# EAGLE design transmission sorter copy (EAGLE 4.13)
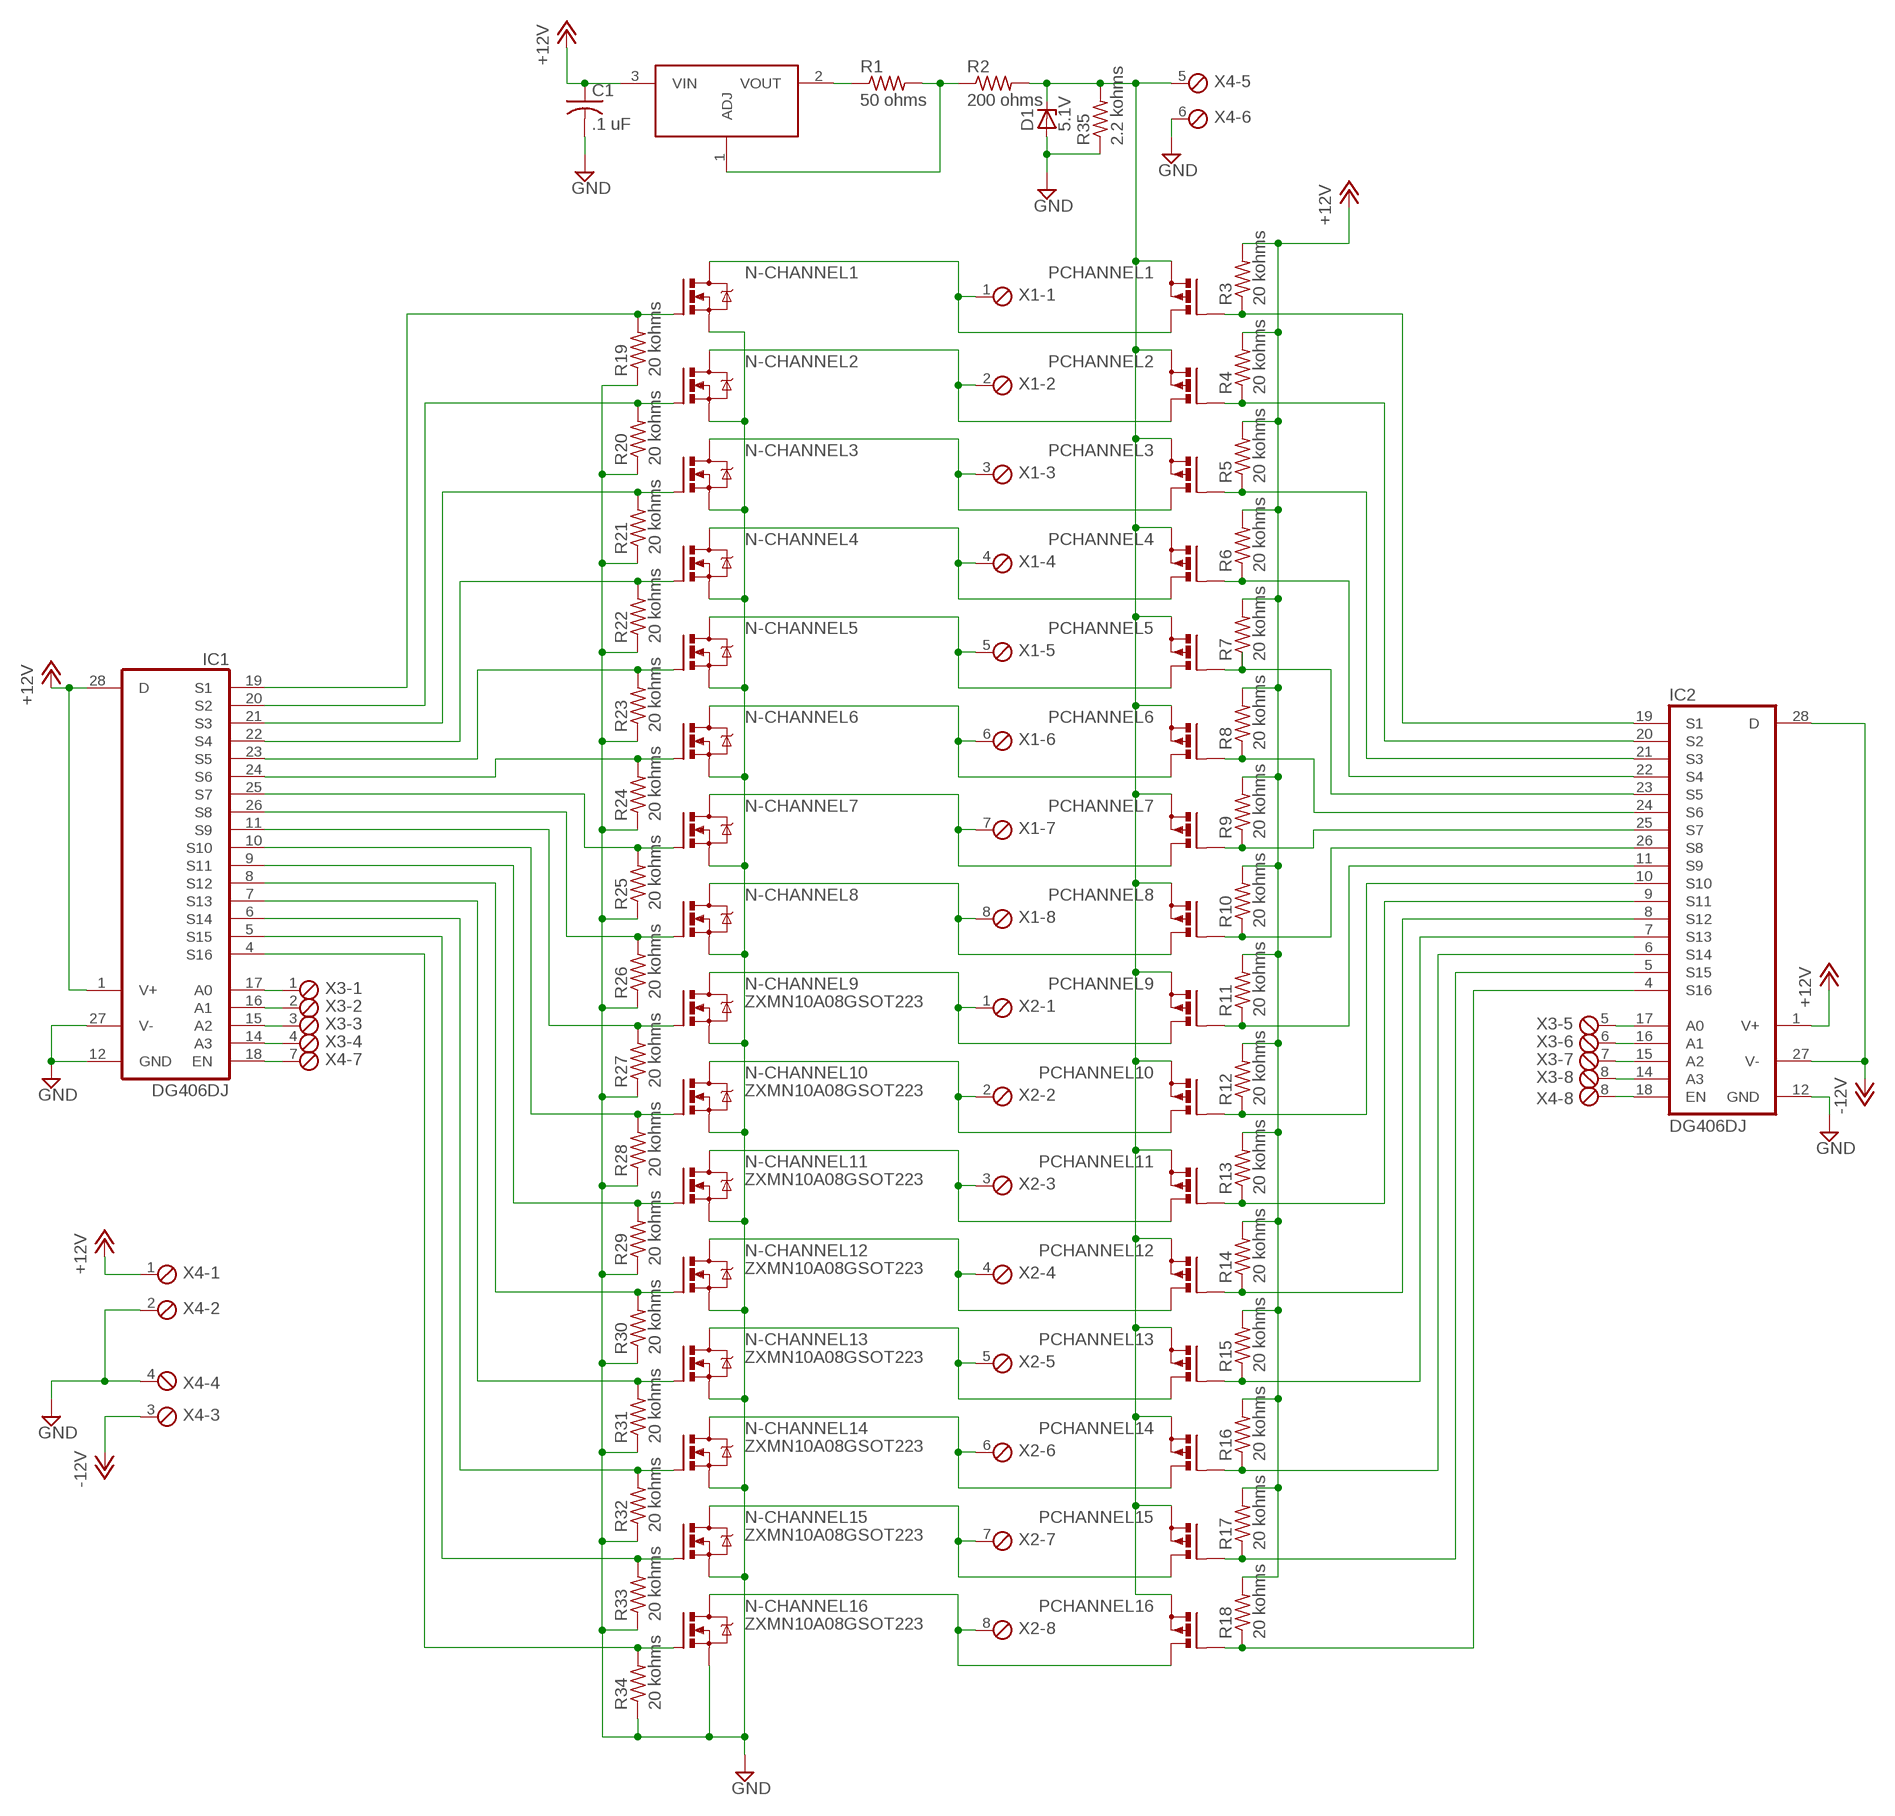
[diagram p0: schematic, sheet 1]

## Parts
C1  .1 uF  CAPACITOR-NO-POLARITYC1210  [C1210]
D1  5.1V  ZENER-DIODEC1702-15  [C1702-15]
IC1  DG406DJ  [DIL28-6]
IC2  DG406DJ  [DIL28-6]
N-CHANNEL1  ZXMN10A08GSOT223  [SOT223R_INFINEON]
N-CHANNEL2  ZXMN10A08GSOT223  [SOT223R_INFINEON]
N-CHANNEL3  ZXMN10A08GSOT223  [SOT223R_INFINEON]
N-CHANNEL4  ZXMN10A08GSOT223  [SOT223R_INFINEON]
N-CHANNEL5  ZXMN10A08GSOT223  [SOT223R_INFINEON]
N-CHANNEL6  ZXMN10A08GSOT223  [SOT223R_INFINEON]
N-CHANNEL7  ZXMN10A08GSOT223  [SOT223R_INFINEON]
N-CHANNEL8  ZXMN10A08GSOT223  [SOT223R_INFINEON]
N-CHANNEL9  ZXMN10A08GSOT223  [SOT223R_INFINEON]
N-CHANNEL10  ZXMN10A08GSOT223  [SOT223R_INFINEON]
N-CHANNEL11  ZXMN10A08GSOT223  [SOT223R_INFINEON]
N-CHANNEL12  ZXMN10A08GSOT223  [SOT223R_INFINEON]
N-CHANNEL13  ZXMN10A08GSOT223  [SOT223R_INFINEON]
N-CHANNEL14  ZXMN10A08GSOT223  [SOT223R_INFINEON]
N-CHANNEL15  ZXMN10A08GSOT223  [SOT223R_INFINEON]
N-CHANNEL16  ZXMN10A08GSOT223  [SOT223R_INFINEON]
PCHANNEL1  PMOSFET_P  [SOT223]
PCHANNEL2  PMOSFET_P  [SOT223]
PCHANNEL3  PMOSFET_P  [SOT223]
PCHANNEL4  PMOSFET_P  [SOT223]
PCHANNEL5  PMOSFET_P  [SOT223]
PCHANNEL6  PMOSFET_P  [SOT223]
PCHANNEL7  PMOSFET_P  [SOT223]
PCHANNEL8  PMOSFET_P  [SOT223]
PCHANNEL9  PMOSFET_P  [SOT223]
PCHANNEL10  PMOSFET_P  [SOT223]
PCHANNEL11  PMOSFET_P  [SOT223]
PCHANNEL12  PMOSFET_P  [SOT223]
PCHANNEL13  PMOSFET_P  [SOT223]
PCHANNEL14  PMOSFET_P  [SOT223]
PCHANNEL15  PMOSFET_P  [SOT223]
PCHANNEL16  PMOSFET_P  [SOT223]
R1  50 ohms  RESISITOR0411/3V  [0411V]
R2  200 ohms  RESISITORM1206  [M1206]
R3  20 kohms  RESISITORM1206  [M1206]
R4  20 kohms  RESISITORM1206  [M1206]
R5  20 kohms  RESISITORM1206  [M1206]
R6  20 kohms  RESISITORM1206  [M1206]
R7  20 kohms  RESISITORM1206  [M1206]
R8  20 kohms  RESISITORM1206  [M1206]
R9  20 kohms  RESISITORM1206  [M1206]
R10  20 kohms  RESISITORM1206  [M1206]
R11  20 kohms  RESISITORM1206  [M1206]
R12  20 kohms  RESISITORM1206  [M1206]
R13  20 kohms  RESISITORM1206  [M1206]
R14  20 kohms  RESISITORM1206  [M1206]
R15  20 kohms  RESISITORM1206  [M1206]
R16  20 kohms  RESISITORM1206  [M1206]
R17  20 kohms  RESISITORM1206  [M1206]
R18  20 kohms  RESISITORM1206  [M1206]
R19  20 kohms  RESISITORM1206  [M1206]
R20  20 kohms  RESISITORM1206  [M1206]
R21  20 kohms  RESISITORM1206  [M1206]
R22  20 kohms  RESISITORM1206  [M1206]
R23  20 kohms  RESISITORM1206  [M1206]
R24  20 kohms  RESISITORM1206  [M1206]
R25  20 kohms  RESISITORM1206  [M1206]
R26  20 kohms  RESISITORM1206  [M1206]
R27  20 kohms  RESISITORM1206  [M1206]
R28  20 kohms  RESISITORM1206  [M1206]
R29  20 kohms  RESISITORM1206  [M1206]
R30  20 kohms  RESISITORM1206  [M1206]
R31  20 kohms  RESISITORM1206  [M1206]
R32  20 kohms  RESISITORM1206  [M1206]
R33  20 kohms  RESISITORM1206  [M1206]
R34  20 kohms  RESISITORM1206  [M1206]
R35  2.2 kohms  RESISITORM1206  [M1206]
U$1  LM317123  [TO220S]
X1  MPT8  [8POL254]
X2  MPT8  [8POL254]
X3  MPT8  [8POL254]
X4  MPT8  [8POL254]

## Nets
+12V: C1.1 IC1.1(V+) IC1.28(D) IC2.1(V+) R3.2 R4.2 R5.2 R6.2 R7.2 R8.2 R9.2 R10.2 R11.2 R12.2 R13.2 R14.2 R15.2 R16.2 R17.2 R18.2 U$1.3(VIN) X4.1
-12V: IC2.27(V-) IC2.28(D) X4.3
GND: C1.2 D1.A IC1.12(GND) IC1.27(V-) IC2.12(GND) N-CHANNEL1.3(S) N-CHANNEL2.3(S) N-CHANNEL3.3(S) N-CHANNEL4.3(S) N-CHANNEL5.3(S) N-CHANNEL6.3(S) N-CHANNEL7.3(S) N-CHANNEL8.3(S) N-CHANNEL9.3(S) N-CHANNEL10.3(S) N-CHANNEL11.3(S) N-CHANNEL12.3(S) N-CHANNEL13.3(S) N-CHANNEL14.3(S) N-CHANNEL15.3(S) N-CHANNEL16.3(S) R19.1 R20.1 R21.1 R22.1 R23.1 R24.1 R25.1 R26.1 R27.1 R28.1 R29.1 R30.1 R31.1 R32.1 R33.1 R34.1 R35.1 X4.2 X4.4 X4.6
N$1: R1.1 U$1.2(VOUT)
N$2: IC2.17(A0) X3.5
N$3: D1.C PCHANNEL1.3(S) PCHANNEL2.3(S) PCHANNEL3.3(S) PCHANNEL4.3(S) PCHANNEL5.3(S) PCHANNEL6.3(S) PCHANNEL7.3(S) PCHANNEL8.3(S) PCHANNEL9.3(S) PCHANNEL10.3(S) PCHANNEL11.3(S) PCHANNEL12.3(S) PCHANNEL13.3(S) PCHANNEL14.3(S) PCHANNEL15.3(S) PCHANNEL16.3(S) R2.2 R35.2 X4.5
N$4: IC2.11(S9) PCHANNEL9.1(G) R11.1
N$5: R1.2 R2.1 U$1.1(ADJ)
N$6: IC2.26(S8) PCHANNEL8.1(G) R10.1
N$7: IC2.10(S10) PCHANNEL10.1(G) R12.1
N$8: IC2.9(S11) PCHANNEL11.1(G) R13.1
N$9: IC2.8(S12) PCHANNEL12.1(G) R14.1
N$10: IC2.7(S13) PCHANNEL13.1(G) R15.1
N$11: IC2.6(S14) PCHANNEL14.1(G) R16.1
N$12: IC2.5(S15) PCHANNEL15.1(G) R17.1
N$13: IC2.4(S16) PCHANNEL16.1(G) R18.1
N$14: IC2.25(S7) PCHANNEL7.1(G) R9.1
N$15: IC2.24(S6) PCHANNEL6.1(G) R8.1
N$16: IC2.23(S5) PCHANNEL5.1(G) R7.1
N$17: IC2.22(S4) PCHANNEL4.1(G) R6.1
N$18: IC2.21(S3) PCHANNEL3.1(G) R5.1
N$19: IC2.20(S2) PCHANNEL2.1(G) R4.1
N$20: IC2.19(S1) PCHANNEL1.1(G) R3.1
N$21: N-CHANNEL7.2(D) PCHANNEL7.2(D) X1.7
N$22: N-CHANNEL6.2(D) PCHANNEL6.2(D) X1.6
N$23: IC1.19(S1) N-CHANNEL1.1(G) R19.2
N$24: IC1.20(S2) N-CHANNEL2.1(G) R20.2
N$25: IC1.21(S3) N-CHANNEL3.1(G) R21.2
N$26: IC1.22(S4) N-CHANNEL4.1(G) R22.2
N$27: IC1.23(S5) N-CHANNEL5.1(G) R23.2
N$28: IC1.24(S6) N-CHANNEL6.1(G) R24.2
N$29: IC1.25(S7) N-CHANNEL7.1(G) R25.2
N$30: IC1.26(S8) N-CHANNEL8.1(G) R26.2
N$31: IC1.11(S9) N-CHANNEL9.1(G) R27.2
N$32: IC1.10(S10) N-CHANNEL10.1(G) R28.2
N$33: IC1.9(S11) N-CHANNEL11.1(G) R29.2
N$34: IC1.8(S12) N-CHANNEL12.1(G) R30.2
N$35: IC1.7(S13) N-CHANNEL13.1(G) R31.2
N$36: IC1.6(S14) N-CHANNEL14.1(G) R32.2
N$37: IC1.5(S15) N-CHANNEL15.1(G) R33.2
N$38: IC1.4(S16) N-CHANNEL16.1(G) R34.2
N$39: N-CHANNEL16.2(D) PCHANNEL16.2(D) X2.8
N$40: N-CHANNEL15.2(D) PCHANNEL15.2(D) X2.7
N$41: N-CHANNEL14.2(D) PCHANNEL14.2(D) X2.6
N$42: N-CHANNEL13.2(D) PCHANNEL13.2(D) X2.5
N$43: N-CHANNEL12.2(D) PCHANNEL12.2(D) X2.4
N$44: N-CHANNEL11.2(D) PCHANNEL11.2(D) X2.3
N$45: N-CHANNEL10.2(D) PCHANNEL10.2(D) X2.2
N$46: N-CHANNEL9.2(D) PCHANNEL9.2(D) X2.1
N$47: N-CHANNEL8.2(D) PCHANNEL8.2(D) X1.8
N$48: N-CHANNEL5.2(D) PCHANNEL5.2(D) X1.5
N$49: N-CHANNEL4.2(D) PCHANNEL4.2(D) X1.4
N$50: N-CHANNEL3.2(D) PCHANNEL3.2(D) X1.3
N$51: N-CHANNEL2.2(D) PCHANNEL2.2(D) X1.2
N$52: N-CHANNEL1.2(D) PCHANNEL1.2(D) X1.1
N$53: IC2.16(A1) X3.6
N$54: IC2.15(A2) X3.7
N$55: IC2.14(A3) X3.8
N$56: IC1.17(A0) X3.1
N$57: IC1.16(A1) X3.2
N$58: IC1.15(A2) X3.3
N$59: IC1.14(A3) X3.4
N$60: IC2.18(EN) X4.8
N$61: IC1.18(EN) X4.7

## Library data of the parts
C1 = 1 Dan's Common Parts:CAPACITOR-NO-POLARITY: CAPACITOR, American symbol
D1 = 1 Dan's Common Parts:ZENER-DIODE: Z-Diode
IC1 IC2 = maxim:DG406DJ: ANALOG MULTIPLEXER
N-CHANNEL1-N-CHANNEL16 = 1 Dan's Common Parts:ZXMN10A08G: N-CHANNEL MOS FET
PCHANNEL1-PCHANNEL16 = 1 Dan's Common Parts:PMOSFET_P: Power MOSFET P-Channel
R1-R35 = 1 Dan's Common Parts:RESISITOR: RESISTOR, American symbol
U$1 = 1 Dan's Common Parts:LM317
X1-X4 = con-phoenix-254:MPT8: PHOENIX CONNECTOR

## Board
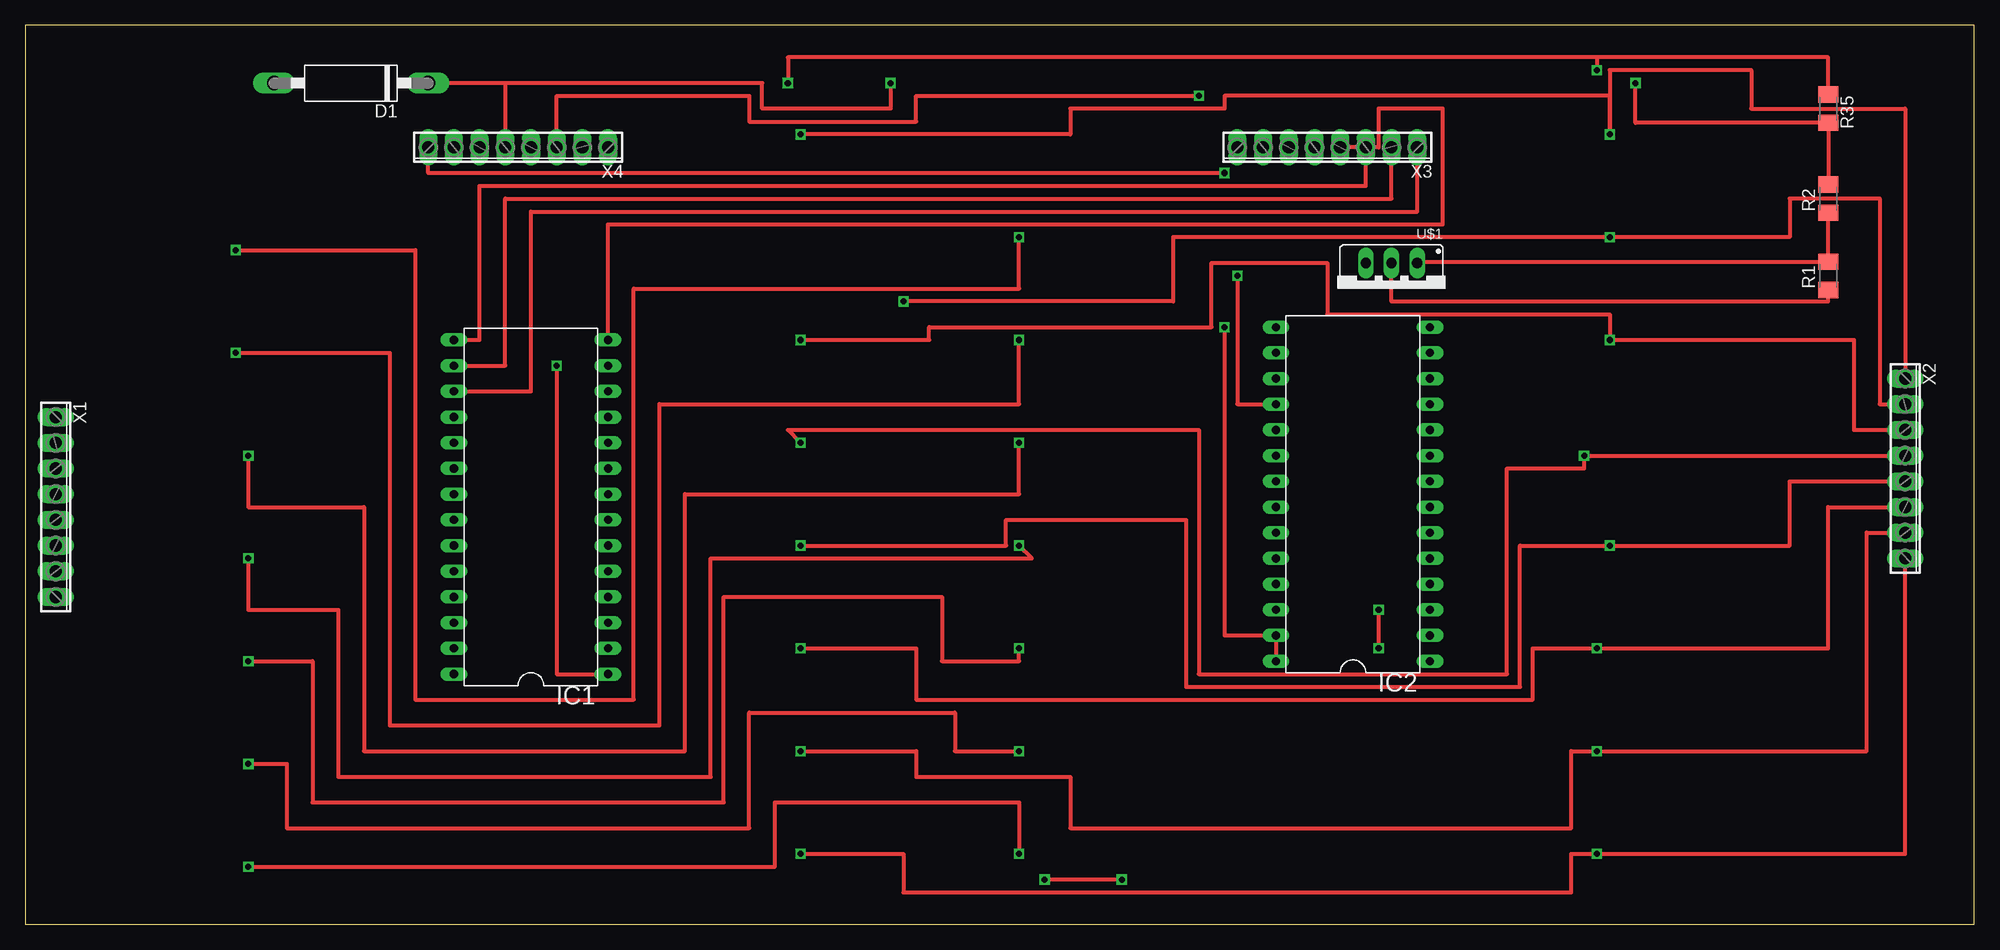
[diagram p1: board, top side]
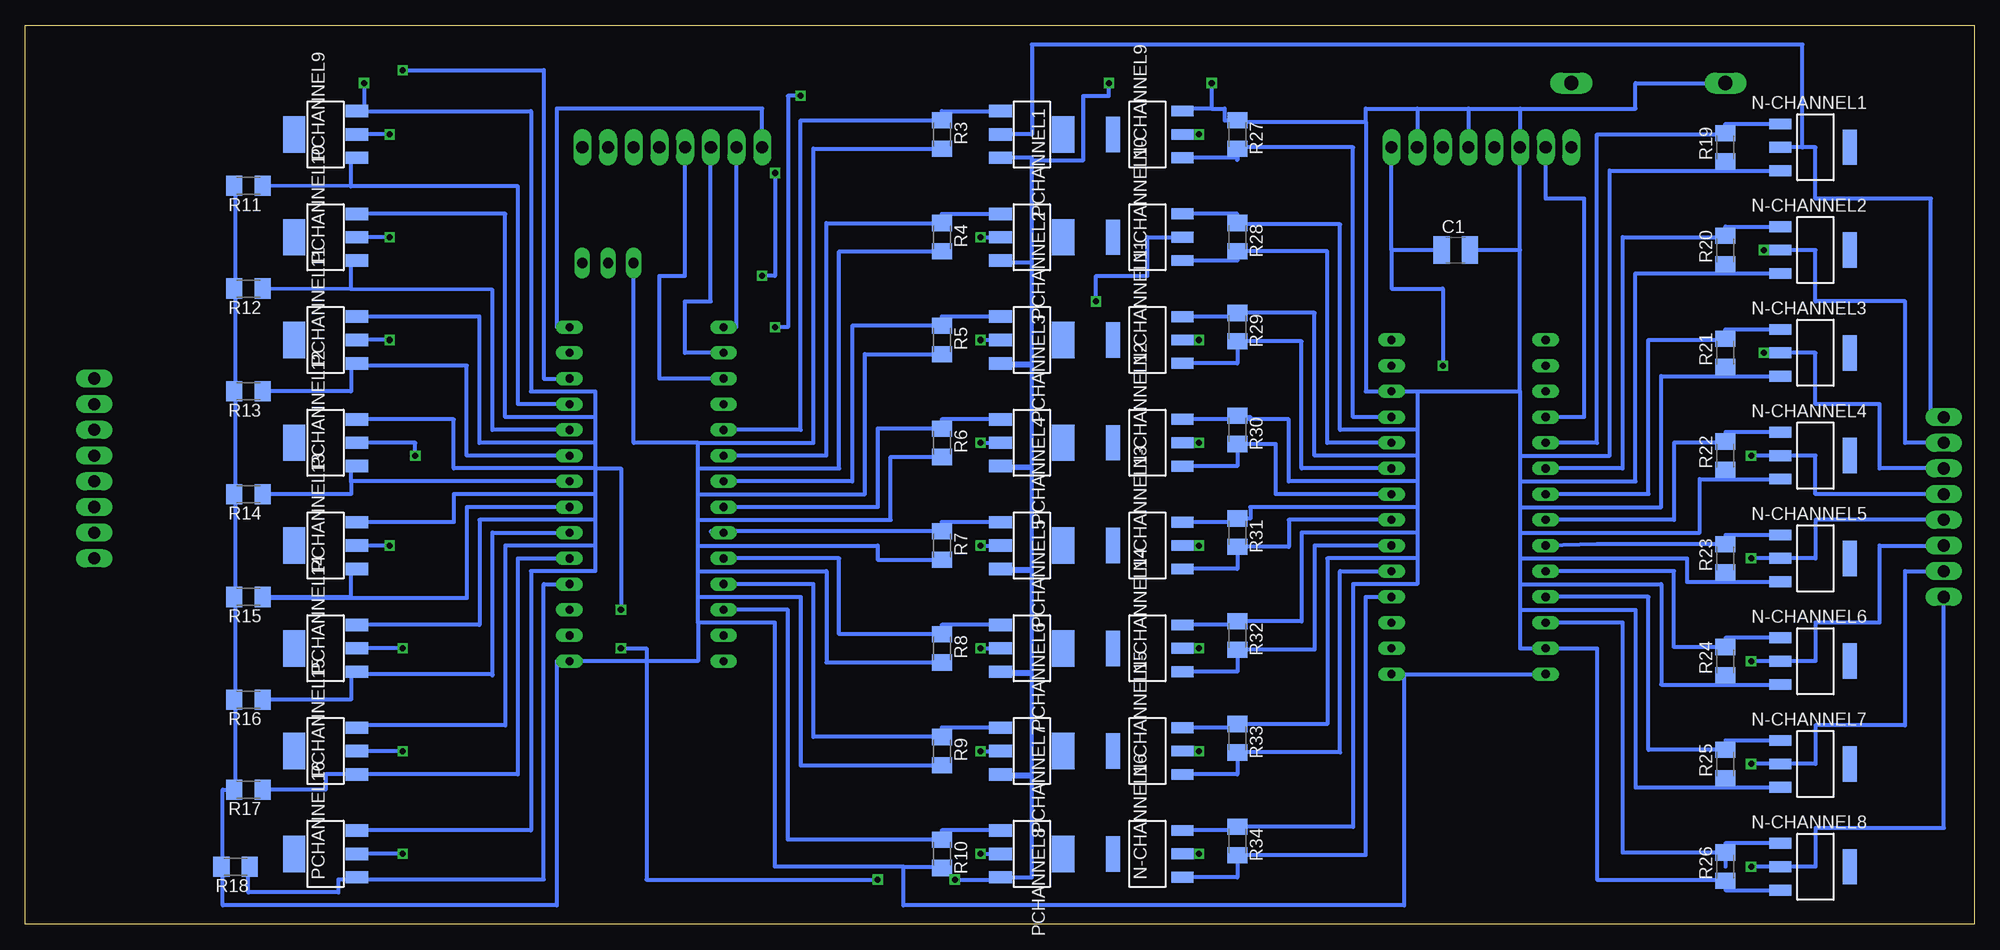
[diagram p2: board, bottom side, seen from below]

Size 192.71 x 88.89 mm. Coordinates in mm from the lower left corner, seen from the top.
Outline: 0,0 192.71,0 192.71,88.89 0,88.89 0,0
Copper layers (1*16): Top 0.035mm / dielectric 1.5mm / Bottom 0.035mm
Design rules "default": minimum track width 10mil, minimum drill 24mil, track to track 8mil, track to pad 8mil, pad to pad 8mil, via to via 8mil, smd to smd 8mil, copper to edge 40mil, drill to drill 8mil, minimum pad ring 10mil, minimum via ring 8mil, stop-mask expansion 4mil, vias tented up to drill 0mil, thermal gap 10mil

### Footprints (pad centres in the part's own frame; a part is rotated, then mirrored left to right if it is on the bottom)
C1210 = smd 1.6 x 2.7: 1 -1.4,0; 2 1.4,0
C1702-15 = drill 1.397 long: A 7.62,0; C -7.62,0
DIL28-6 = drill 0.813 long: 1 -16.51,-7.62; 2 -13.97,-7.62; 3 -11.43,-7.62; 4 -8.89,-7.62; 5 -6.35,-7.62; 6 -3.81,-7.62; 7 -1.27,-7.62; 8 1.27,-7.62; 9 3.81,-7.62; 10 6.35,-7.62; 11 8.89,-7.62; 12 11.43,-7.62; 13 13.97,-7.62; 14 16.51,-7.62; 15 16.51,7.62; 16 13.97,7.62; 17 11.43,7.62; 18 8.89,7.62; 19 6.35,7.62; 20 3.81,7.62; 21 1.27,7.62; 22 -1.27,7.62; 23 -3.81,7.62; 24 -6.35,7.62; 25 -8.89,7.62; 26 -11.43,7.62; 27 -13.97,7.62; 28 -16.51,7.62
SOT223R_INFINEON = smd 1.067 x 2.184: 1 -2.311,-3.479; 2 0,-3.48; 3 2.312,-3.48 | smd 3.5 x 1.4: 4 0,3.404
SOT223 = smd 1.219 x 2.235: 1 -2.311,-3.099; 2 0,-3.099; 3 2.311,-3.099 | smd 3.6 x 2.2: 4 0,3.099
M1206 = smd 1.6 x 2: 1 -1.4,0; 2 1.4,0
TO220S = drill 1.016 long: 1 -2.54,-2.54; 2 0,-2.54; 3 2.54,-2.54
8POL254 = drill 1.2 long: 1 -8.89,0; 2 -6.35,0; 3 -3.81,0; 4 -1.27,0; 5 1.27,0; 6 3.81,0; 7 6.35,0; 8 8.89,0

### Placement (x,y rotation side)
C1  51.27,66.67 0 bottom
D1  32.22,83.18 180 top
IC1  50,41.27 90 top
IC2  131.28,42.54 90 top
N-CHANNEL1  15.71,76.83 270 bottom
N-CHANNEL2  15.71,66.67 270 bottom
N-CHANNEL3  15.71,56.51 270 bottom
N-CHANNEL4  15.71,46.35 270 bottom
N-CHANNEL5  15.71,36.19 270 bottom
N-CHANNEL6  15.71,26.03 270 bottom
N-CHANNEL7  15.71,15.87 270 bottom
N-CHANNEL8  15.71,5.71 270 bottom
N-CHANNEL9  81.75,78.1 90 bottom
N-CHANNEL10  81.75,67.94 90 bottom
N-CHANNEL11  81.75,57.78 90 bottom
N-CHANNEL12  81.75,47.62 90 bottom
N-CHANNEL13  81.75,37.46 90 bottom
N-CHANNEL14  81.75,27.3 90 bottom
N-CHANNEL15  81.75,17.14 90 bottom
N-CHANNEL16  81.75,6.98 90 bottom
PCHANNEL1  93.18,78.1 270 bottom
PCHANNEL2  93.18,67.94 270 bottom
PCHANNEL3  93.18,57.78 270 bottom
PCHANNEL4  93.18,47.62 270 bottom
PCHANNEL5  93.18,37.46 270 bottom
PCHANNEL6  93.18,27.3 270 bottom
PCHANNEL7  93.18,17.14 270 bottom
PCHANNEL8  93.18,6.98 270 bottom
PCHANNEL9  163.03,78.1 90 bottom
PCHANNEL10  163.03,67.94 90 bottom
PCHANNEL11  163.03,57.78 90 bottom
PCHANNEL12  163.03,47.62 90 bottom
PCHANNEL13  163.03,37.46 90 bottom
PCHANNEL14  163.03,27.3 90 bottom
PCHANNEL15  163.03,17.14 90 bottom
PCHANNEL16  163.03,6.98 90 bottom
R1  50 ohms  [M1206]  178.27,64.13 90 top
R2  178.27,71.75 90 top
R3  102.07,78.1 270 bottom
R4  102.07,67.94 270 bottom
R5  102.07,57.78 270 bottom
R6  102.07,47.62 270 bottom
R7  102.07,37.46 270 bottom
R8  102.07,27.3 270 bottom
R9  102.07,17.14 270 bottom
R10  102.07,6.98 270 bottom
R11  170.65,73.02 180 bottom
R12  170.65,62.86 180 bottom
R13  170.65,52.7 180 bottom
R14  170.65,42.54 180 bottom
R15  170.65,32.38 180 bottom
R16  170.65,22.22 180 bottom
R17  170.65,13.33 180 bottom
R18  171.92,5.71 180 bottom
R19  24.6,76.83 90 bottom
R20  24.6,66.67 90 bottom
R21  24.6,56.51 90 bottom
R22  24.6,46.35 90 bottom
R23  24.6,36.19 90 bottom
R24  24.6,26.03 90 bottom
R25  24.6,15.87 90 bottom
R26  24.6,5.71 90 bottom
R27  72.86,78.1 270 bottom
R28  72.86,67.94 270 bottom
R29  72.86,59.05 270 bottom
R30  72.86,48.89 270 bottom
R31  72.86,38.73 270 bottom
R32  72.86,28.57 270 bottom
R33  72.86,18.41 270 bottom
R34  72.86,8.25 270 bottom
R35  178.27,80.64 270 top
U$1  135.09,62.86 180 top
X1  3.01,41.27 270 top
X2  185.89,45.08 270 top
X3  128.74,76.83 180 top
X4  48.73,76.83 180 top

### Tracks (layer width: path | path; a pad name or v marks a point on that pad's centre or on a via)
+12V  (via drill 0.6)
  Top 0.406: v52.54,55.24 52.54,24.76 IC1.1
  Bottom 0.406: R9.2 116.04,15.74 116.04,32.38 126.2,32.38 | 126.2,29.84 126.2,32.38 | 126.2,29.84 118.58,29.84 118.58,5.71 105.88,5.71 | R10.2 102.07,5.71 105.88,5.71 | R8.2 113.5,25.9 113.5,34.92 126.2,34.92 | 126.2,32.38 126.2,34.92 | R7.2 108.42,36.06 108.42,37.46 126.2,37.46 | 126.2,34.92 126.2,37.46 | R6.2 107.15,46.22 107.15,40 126.2,40 | 126.2,37.46 126.2,40 | R5.2 109.69,56.38 109.69,42.54 126.2,42.54 | 126.2,40 126.2,42.54 | R4.2 112.23,66.54 112.23,45.08 126.2,45.08 | 126.2,42.54 126.2,45.08 | R3.2 114.77,76.7 114.77,47.62 126.2,47.62 | 126.2,45.08 126.2,47.62 | 171.92,22.22 171.92,13.33 R17.2 173.19,13.33 173.19,5.71 | 171.92,22.22 R16.2 | 171.92,22.22 171.92,32.38 | 171.92,32.38 R15.2 | 171.92,32.38 171.92,42.54 | 171.92,42.54 R14.2 | 171.92,42.54 171.92,52.7 | 171.92,52.7 R13.2 | 171.92,52.7 171.92,62.86 | R11.2 171.92,73.02 171.92,62.86 | 171.92,62.86 R12.2 | 126.2,29.84 126.2,26.03 IC2.1 140.17,26.03 140.17,1.9 173.19,1.9 173.19,5.71 | 173.19,5.71 R18.2 | 56.35,24.76 IC1.28 | 56.35,24.76 IC1.1 | 56.35,24.76 56.35,1.9 105.88,1.9 105.88,5.71 | C1.1 57.62,66.67 | 57.62,66.67 X4.1 | 126.2,47.62 132.55,47.62 U$1.3 | 57.62,66.67 57.62,62.86 52.54,62.86 v52.54,55.24
-12V  (via drill 0.6)
  Top 0.406: IC2.28 IC2.27 118.58,28.57 v118.58,59.05 | v116.04,81.91 88.1,81.91 88.1,79.37 71.59,79.37 71.59,81.91 52.54,81.91 X4.3
  Bottom 0.406: v118.58,59.05 117.31,59.05 117.31,81.91 v116.04,81.91
GND  (via drill 0.6)
  Top 0.406: R35.1 178.27,85.72 155.41,85.72 | 155.41,85.72 v155.41,84.45 | 155.41,85.72 75.4,85.72 v75.4,83.18
  Bottom 0.406: 24.6,75.56 R19.1 24.6,74.52 | 24.6,74.52 N-CHANNEL1.3 | 24.6,65.4 R20.1 24.6,64.36 | 24.6,64.36 N-CHANNEL2.3 | 24.6,55.24 R21.1 24.6,54.2 | 24.6,54.2 N-CHANNEL3.3 | 24.6,45.08 R22.1 24.6,44.04 | 24.6,44.04 N-CHANNEL4.3 | 24.6,34.92 R23.1 24.6,33.88 | 24.6,33.88 N-CHANNEL5.3 | 24.6,24.76 R24.1 24.6,23.72 | 24.6,23.72 N-CHANNEL6.3 | 24.6,14.6 R25.1 24.6,13.56 | 24.6,13.56 N-CHANNEL7.3 | N-CHANNEL8.3 24.6,3.4 R26.1 24.6,4.44 37.3,4.44 37.3,27.3 IC1.27 44.92,27.3 44.92,31.11 | 24.6,13.56 33.49,13.56 33.49,31.11 44.92,31.11 | 24.6,23.72 30.95,23.72 30.95,33.65 44.92,33.65 | 44.92,33.65 44.92,31.11 | 24.6,33.88 28.41,33.88 28.41,36.19 44.92,36.19 | 44.92,36.19 44.92,33.65 | 24.6,44.04 27.14,44.04 27.14,38.73 44.92,38.73 | 44.92,38.73 44.92,36.19 | 24.6,54.2 30.95,54.2 30.95,41.27 44.92,41.27 | 44.92,41.27 44.92,38.73 | 24.6,64.36 33.49,64.36 33.49,43.81 44.92,43.81 | 44.92,43.81 44.92,41.27 | 24.6,74.52 36.03,74.52 36.03,46.35 44.92,46.35 | 44.92,46.35 44.92,43.81 | 44.92,52.7 44.92,46.35 | 44.92,52.7 44.92,66.67 | 44.92,66.67 X4.6 44.92,80.64 | 50,80.64 44.92,80.64 | 50,80.64 X4.4 | 55.08,80.64 X4.2 | 55.08,80.64 50,80.64 | 75.4,80.64 74.13,80.64 74.13,79.5 R27.1 72.86,79.37 60.16,79.37 | 75.4,80.64 77.94,80.64 | 77.94,80.64 77.94,80.41 N-CHANNEL9.3 | 77.94,80.64 79.21,80.64 | N-CHANNEL10.3 72.86,70.25 R28.1 72.86,69.21 62.7,69.21 62.7,48.89 55.08,48.89 | N-CHANNEL11.3 72.86,60.09 R29.1 65.24,60.45 65.24,46.35 55.08,46.35 | 71.59,49.93 N-CHANNEL12.3 | 71.59,49.93 71.59,50.16 72.86,50.16 R30.1 | N-CHANNEL13.3 72.86,39.77 R31.1 71.59,40.13 71.59,41.27 55.08,41.27 | N-CHANNEL14.3 72.86,29.61 R32.1 66.51,29.97 66.51,38.73 55.08,38.73
  Bottom 0.406: N-CHANNEL15.3 72.86,19.45 R33.1 63.97,19.81 63.97,36.19 55.08,36.19 | N-CHANNEL16.3 72.86,9.29 R34.1 61.43,9.65 61.43,33.65 55.08,33.65 55.08,36.19 | 55.08,52.7 44.92,52.7 | 55.08,52.7 IC1.12 60.16,52.7 60.16,79.37 | 55.08,52.7 55.08,48.89 | 55.08,48.89 55.08,46.35 | 71.59,49.93 67.78,49.93 67.78,43.81 55.08,43.81 | 55.08,46.35 55.08,43.81 | 55.08,43.81 55.08,41.27 | 55.08,41.27 55.08,38.73 | 55.08,38.73 55.08,36.19 | 44.92,66.67 C1.2 | 55.08,80.64 60.16,80.64 60.16,79.37 | IC2.12 141.44,53.97 141.44,84.45 v155.41,84.45 | v75.4,83.18 75.4,80.64 | D1.A 33.49,83.18 33.49,80.64 44.92,80.64
N$1
  Top 0.406: U$1.2 135.09,61.59 178.27,61.59 R1.1
N$2
  Bottom 0.406: IC2.17 130.01,53.97 130.01,64.13 127.47,64.13 X3.5
N$3  (via drill 0.6)
  Top 0.406: 47.46,83.18 D1.C | v159.22,83.18 159.22,79.24 R35.2 R2.2 178.27,73.02 | 47.46,83.18 X4.5 | 47.46,83.18 72.86,83.18 72.86,80.64 85.56,80.64 v85.56,83.18 | v133.82,31.11 v133.82,27.3 | v108.42,4.44 v100.8,4.44
  Bottom 0.406: PCHANNEL16.3 142.71,9.29 142.71,34.92 136.36,34.92 136.36,37.46 | 136.36,37.46 145.25,37.46 145.25,19.68 160.49,19.68 160.49,19.45 PCHANNEL15.3 | PCHANNEL14.3 147.79,29.61 147.79,40 136.36,40 | 136.36,40 136.36,37.46 | PCHANNEL13.3 150.33,39.77 150.33,42.54 136.36,42.54 | 136.36,42.54 136.36,40 | PCHANNEL12.3 150.33,49.93 150.33,45.08 136.36,45.08 | 136.36,45.08 136.36,42.54 | PCHANNEL11.3 147.79,60.09 147.79,47.62 136.36,47.62 | 136.36,47.62 136.36,45.08 | PCHANNEL10.3 145.25,70.25 145.25,50.16 136.36,50.16 | 136.36,50.16 136.36,47.62 | 159.22,80.41 142.71,80.41 142.71,52.7 136.36,52.7 136.36,50.16 | 159.22,80.41 PCHANNEL9.3 | 95.72,4.67 93.18,4.67 93.18,14.6 95.72,14.6 | 95.72,4.67 PCHANNEL8.3 | 95.72,14.6 96.99,14.6 | 95.72,14.83 93.18,14.83 93.18,24.76 95.72,24.76 | 95.72,14.83 PCHANNEL7.3 | 95.72,24.76 96.99,24.76 | 95.72,24.99 93.18,24.99 93.18,34.92 95.72,34.92 95.72,35.15 | 95.72,24.99 PCHANNEL6.3 | 95.72,35.15 93.18,35.15 93.18,45.08 95.72,45.08 | 95.72,35.15 PCHANNEL5.3 | 95.72,45.08 96.99,45.08 | 95.72,45.31 93.18,45.31 93.18,55.24 95.72,55.24 95.72,55.47 | 95.72,45.31 PCHANNEL4.3 | 95.72,55.47 93.18,55.47 93.18,65.4 | 95.72,55.47 PCHANNEL3.3 | PCHANNEL1.3 93.18,75.79 93.18,75.56 | 93.18,65.4 93.18,75.56 | v159.22,83.18 159.22,80.41 | 93.18,65.4 96.28,65.4 | 96.28,65.4 PCHANNEL2.3 | 96.28,65.4 96.99,65.4 | v85.56,83.18 85.56,81.91 88.1,81.91 88.1,75.56 93.18,75.56 | 136.36,45.08 133.82,45.08 v133.82,31.11 | v133.82,27.3 131.28,27.3 131.28,4.44 v108.42,4.44 | 95.72,4.67 95.72,4.44 v100.8,4.44 | 95.72,14.6 95.72,14.83 | 95.72,24.76 95.72,24.99 | 95.72,45.08 95.72,45.31
N$4
  Bottom 0.406: 160.49,72.97 R11.1 | 143.98,71.75 143.98,51.43 IC2.11 | 143.98,71.75 143.98,72.89 | 160.49,72.97 | PCHANNEL9.1 160.49,75.79 160.49,72.97 | 160.49,72.97 143.98,72.97 143.98,71.75
N$5
  Top 0.406: R1.2 137.63,65.53 U$1.1 | R1.2 178.27,65.4 | R1.2 R2.1
N$6
  Bottom 0.406: R10.1 102.07,8.25 | PCHANNEL8.1 102.07,9.29 R10.1 | R10.1 117.31,8.38 117.31,31.11 IC2.26
N$7
  Bottom 0.406: 160.49,62.81 146.52,62.73 146.52,48.89 IC2.10 | 160.49,62.81 R12.1 | 160.49,62.81 | PCHANNEL10.1 160.49,65.63 160.49,62.81
N$8
  Bottom 0.406: IC2.9 149.06,46.35 149.06,55.24 159.22,55.24 | 160.49,55.24 160.49,55.47 PCHANNEL11.1 159.22,55.47 159.22,55.24 | 160.49,55.24 160.49,52.7 R13.1 169.38,52.7 | 159.22,55.24 160.49,55.24
N$9
  Bottom 0.406: IC2.8 160.49,43.81 | 160.49,43.81 160.49,45.08 160.16,45.08 arc-90 PCHANNEL12.1 | R14.1 160.49,42.54 160.49,43.81
N$10
  Bottom 0.406: IC2.7 149.06,41.27 149.06,32.25 169.38,32.25 169.38,32.38 R15.1 160.49,32.38 160.49,35.15 PCHANNEL13.1
N$11
  Bottom 0.406: 146.52,24.76 146.52,24.63 | 146.52,24.76 146.52,38.73 IC2.6 | R16.1 160.49,22.22 160.49,24.76 | 146.52,24.76 160.49,24.76 | PCHANNEL14.1 160.49,24.99 160.49,24.76
N$12
  Bottom 0.406: IC2.5 143.98,36.19 143.98,14.83 PCHANNEL15.1 163.03,14.83 163.03,13.33 R17.1 169.38,13.33
N$13
  Bottom 0.406: IC2.4 141.44,33.65 141.44,4.44 160.49,4.44 | R18.1 170.65,5.71 170.65,3.17 161.76,3.17 161.76,4.44 160.49,4.44 | PCHANNEL16.1 160.49,4.67 160.49,4.44
N$14
  Bottom 0.406: R9.1 102.07,18.41 | PCHANNEL7.1 102.07,19.45 R9.1 | R9.1 114.77,18.54 114.77,33.65 IC2.25
N$15
  Bottom 0.406: R8.1 102.07,28.57 | PCHANNEL6.1 102.07,29.61 R8.1 | R8.1 112.23,28.7 112.23,36.19 IC2.24
N$16
  Bottom 0.406: R7.1 102.07,38.73 | PCHANNEL5.1 102.07,39.77 R7.1 | R7.1 124.93,38.86 IC2.23
N$17
  Bottom 0.406: R6.1 102.07,48.89 | PCHANNEL4.1 102.07,49.93 R6.1 | R6.1 108.42,49.02 108.42,41.27 IC2.22
N$18
  Bottom 0.406: R5.1 102.07,59.05 | PCHANNEL3.1 102.07,60.09 R5.1 | R5.1 110.96,59.18 110.96,43.81 IC2.21
N$19
  Bottom 0.406: R4.1 102.07,69.21 | PCHANNEL2.1 102.07,70.25 R4.1 | R4.1 113.5,69.34 113.5,46.35 IC2.20
N$20
  Bottom 0.406: R3.1 102.07,79.37 | PCHANNEL1.1 102.07,80.41 R3.1 | R3.1 116.04,79.5 116.04,48.89 IC2.19
N$21  (via drill 0.6)
  Top 0.406: v22.06,15.87 25.87,15.87 25.87,9.52 71.59,9.52 71.59,20.95 91.91,20.95 91.91,17.14 v98.26,17.14
  Bottom 0.406: X1.7 6.82,34.92 6.82,19.68 15.71,19.68 15.71,15.87 N-CHANNEL7.2 v22.06,15.87 | v22.06,15.87 | v98.26,17.14 PCHANNEL7.2 95.72,17.14
N$22  (via drill 0.6)
  Top 0.406: v22.06,26.03 28.41,26.03 28.41,12.06 69.05,12.06 69.05,32.38 90.64,32.38 90.64,26.03 98.26,26.03 v98.26,27.3
  Bottom 0.406: X1.6 9.36,37.46 9.36,29.84 15.71,29.84 15.71,26.03 19.52,26.03 | 19.52,26.03 | 19.52,26.03 N-CHANNEL6.2 | 19.52,26.03 v22.06,26.03 | v22.06,26.03 | v98.26,27.3 PCHANNEL6.2 95.72,27.3
N$23
  Bottom 0.406: N-CHANNEL1.1 24.6,79.14 R19.2 24.6,78.1 37.3,78.1 37.3,47.62 IC1.19
N$24
  Bottom 0.406: N-CHANNEL2.1 24.6,68.98 R20.2 24.6,67.94 34.76,67.94 34.76,45.08 IC1.20
N$25
  Bottom 0.406: N-CHANNEL3.1 24.6,58.82 R21.2 24.6,57.78 32.22,57.78 32.22,42.54 IC1.21
N$26
  Bottom 0.406: N-CHANNEL4.1 24.6,48.66 R22.2 24.6,47.62 29.68,47.62 29.68,40 IC1.22
N$27
  Bottom 0.406: R23.2 24.6,37.46 | N-CHANNEL5.1 24.6,38.5 R23.2 | R23.2 37.3,37.59 IC1.23
N$28
  Bottom 0.406: R24.2 24.6,27.3 | N-CHANNEL6.1 24.6,28.34 R24.2 | R24.2 29.68,27.43 29.68,34.92 IC1.24
N$29
  Bottom 0.406: R25.2 24.6,17.14 | N-CHANNEL7.1 24.6,18.18 R25.2 | R25.2 32.22,17.27 32.22,32.38 IC1.25
N$30
  Bottom 0.406: R26.2 24.6,5.71 | N-CHANNEL8.1 24.6,8.02 R26.2 | R26.2 34.76,7.11 34.76,29.84 IC1.26
N$31
  Bottom 0.406: 72.86,76.83 R27.2 72.86,75.79 | 72.86,75.79 N-CHANNEL9.1 | IC1.11 61.43,50.16 61.43,76.83 72.86,76.83 | 72.86,75.79 72.86,75.56 | 72.86,76.83 72.86,75.79
N$32
  Bottom 0.406: R28.2 72.86,66.67 | N-CHANNEL10.1 72.86,65.63 R28.2 | R28.2 63.97,66.54 63.97,47.62 IC1.10
N$33
  Bottom 0.406: R29.2 72.86,57.78 | N-CHANNEL11.1 72.86,55.47 R29.2 | R29.2 66.51,57.65 66.51,45.08 IC1.9
N$34
  Bottom 0.406: R30.2 72.86,47.62 | N-CHANNEL12.1 72.86,45.31 R30.2 | R30.2 69.05,47.49 69.05,42.54 IC1.8
N$35
  Bottom 0.406: R31.2 72.86,37.46 | N-CHANNEL13.1 72.86,35.15 R31.2 | R31.2 67.78,37.33 67.78,40 IC1.7
N$36
  Bottom 0.406: R32.2 72.86,27.3 | N-CHANNEL14.1 72.86,24.99 R32.2 | R32.2 65.24,27.17 65.24,37.46 IC1.6
N$37
  Bottom 0.406: R33.2 72.86,17.14 | N-CHANNEL15.1 72.86,14.83 R33.2 | R33.2 62.7,17.01 62.7,34.92 IC1.5
N$38
  Bottom 0.406: R34.2 72.86,6.98 | N-CHANNEL16.1 72.86,4.67 R34.2 | R34.2 60.16,6.85 60.16,32.38 IC1.4
N$39  (via drill 0.6)
  Top 0.406: X2.8 185.89,6.98 v155.41,6.98 152.87,6.98 152.87,3.17 86.83,3.17 86.83,6.98 v76.67,6.98
  Bottom 0.406: v155.41,6.98 PCHANNEL16.2 | 77.94,6.98 v76.67,6.98 | 77.94,6.98 79.21,6.98 | N-CHANNEL16.2 77.94,6.98 | 77.94,6.98
N$40  (via drill 0.6)
  Top 0.406: X2.7 182.08,38.73 182.08,17.14 v155.41,17.14 152.87,17.14 152.87,9.52 103.34,9.52 103.34,14.6 88.1,14.6 88.1,17.14 v76.67,17.14
  Bottom 0.406: 160.49,17.14 PCHANNEL15.2 v155.41,17.14 | 77.94,17.14 | 77.94,17.14 N-CHANNEL15.2 | v76.67,17.14 77.94,17.14
N$41  (via drill 0.6)
  Top 0.406: X2.6 178.27,41.27 178.27,27.3 v155.41,27.3 149.06,27.3 149.06,22.22 88.1,22.22 88.1,27.3 v76.67,27.3
  Bottom 0.406: v155.41,27.3 PCHANNEL14.2 160.49,27.3 | 77.94,27.3 v76.67,27.3 | 77.94,27.3 79.21,27.3 | N-CHANNEL14.2 77.94,27.3 | 77.94,27.3
N$42  (via drill 0.6)
  Top 0.406: X2.5 174.46,43.81 174.46,37.46 v156.68,37.46 147.79,37.46 147.79,23.49 114.77,23.49 114.77,40 96.99,40 96.99,37.46 v76.67,37.46
  Bottom 0.406: 160.49,37.46 PCHANNEL13.2 v156.68,37.46 | v76.67,37.46 N-CHANNEL13.2 | v76.67,37.46
N$43  (via drill 0.6)
  Top 0.406: X2.4 v154.14,46.35 154.14,45.08 146.52,45.08 146.52,24.76 116.04,24.76 116.04,48.89 75.4,48.89 v76.67,47.62
  Bottom 0.406: v154.14,46.35 154.14,47.62 PCHANNEL12.2 160.49,47.62 | N-CHANNEL12.2 arc90 N-CHANNEL12.2 | v76.67,47.62 N-CHANNEL12.2
N$44  (via drill 0.6)
  Top 0.406: X2.3 180.81,48.89 180.81,57.78 v156.68,57.78 156.68,60.32 128.74,60.32 128.74,65.4 117.31,65.4 117.31,59.05 89.37,59.05 89.37,57.78 v76.67,57.78
  Bottom 0.406: v156.68,57.78 PCHANNEL11.2 160.49,57.78 | N-CHANNEL11.2 | N-CHANNEL11.2 v76.67,57.78
N$45  (via drill 0.6)
  Top 0.406: v86.83,61.59 113.5,61.59 113.5,67.94 v156.68,67.94 174.46,67.94 174.46,71.75 183.35,71.75 183.35,51.43 X2.2
  Bottom 0.406: N-CHANNEL10.2 | N-CHANNEL10.2 81.75,67.94 81.75,64.13 86.83,64.13 v86.83,61.59 | v156.68,67.94 PCHANNEL10.2 160.49,67.94
N$46  (via drill 0.6)
  Top 0.406: X2.1 185.89,80.64 170.65,80.64 170.65,84.45 156.68,84.45 v156.68,78.1 156.68,81.91 118.58,81.91 118.58,80.64 103.34,80.64 103.34,78.1 v76.67,78.1
  Bottom 0.406: PCHANNEL9.2 v156.68,78.1 PCHANNEL9.2 | PCHANNEL9.2 160.49,78.1 | N-CHANNEL9.2 | v76.67,78.1 N-CHANNEL9.2
N$47  (via drill 0.6)
  Top 0.406: v22.06,5.71 74.13,5.71 74.13,12.06 98.26,12.06 v98.26,6.98
  Bottom 0.406: X1.8 3.01,9.52 15.71,9.52 15.71,5.71 N-CHANNEL8.2 v22.06,5.71 | v22.06,5.71 | v98.26,6.98 PCHANNEL8.2 95.72,6.98
N$48  (via drill 0.6)
  Top 0.406: v22.06,36.19 22.06,31.11 30.95,31.11 30.95,14.6 67.78,14.6 67.78,36.19 99.53,36.19 v98.26,37.46
  Bottom 0.406: X1.5 15.71,40 15.71,36.19 N-CHANNEL5.2 v22.06,36.19 | v22.06,36.19 | v98.26,37.46 PCHANNEL5.2 95.72,37.46
N$49  (via drill 0.6)
  Top 0.406: v22.06,46.35 22.06,41.27 33.49,41.27 33.49,17.14 65.24,17.14 65.24,42.54 98.26,42.54 v98.26,47.62
  Bottom 0.406: 1.74,42.54 X1.4 15.71,42.54 15.71,46.35 N-CHANNEL4.2 v22.06,46.35 | v22.06,46.35 | v98.26,47.62 PCHANNEL4.2 95.72,47.62
N$50  (via drill 0.6)
  Top 0.406: v20.79,56.51 36.03,56.51 36.03,19.68 62.7,19.68 62.7,51.43 98.26,51.43 v98.26,57.78
  Bottom 0.406: X1.3 9.36,45.08 9.36,51.43 15.71,51.43 15.71,56.51 19.52,56.51 | 19.52,56.51 | 19.52,56.51 N-CHANNEL3.2 | 19.52,56.51 v20.79,56.51 | v20.79,56.51 | v98.26,57.78 PCHANNEL3.2 95.72,57.78
N$51  (via drill 0.6)
  Top 0.406: v20.79,66.67 38.57,66.67 38.57,22.22 60.16,22.22 60.16,62.86 98.26,62.86 v98.26,67.94
  Bottom 0.406: X1.2 6.82,47.62 6.82,61.59 15.71,61.59 15.71,66.67 19.52,66.67 | 19.52,66.67 | 19.52,66.67 N-CHANNEL2.2 | 19.52,66.67 v20.79,66.67 | v20.79,66.67 | v98.26,67.94 PCHANNEL2.2 95.72,67.94
N$52
  Bottom 0.406: X1.1 4.28,50.16 4.28,71.75 15.71,71.75 15.71,76.83 | 19.52,76.83 | 19.52,76.83 N-CHANNEL1.2 | 15.71,76.83 19.52,76.83 | 15.71,76.83 19.52,76.83 | 15.71,76.83 | 15.71,76.83 16.98,76.83 16.98,86.99 93.18,86.99 93.18,78.1 PCHANNEL1.2
N$53
  Bottom 0.406: IC2.16 127.47,56.51 127.47,61.59 124.93,61.59 X3.6
N$54
  Bottom 0.406: IC2.15 122.39,59.05 X3.7
N$55
  Bottom 0.406: IC2.14 140.17,59.05 140.17,80.64 119.85,80.64 X3.8
N$56
  Top 0.406: IC1.17 50,52.7 50,70.48 137.63,70.48 X3.1
N$57
  Top 0.406: IC1.16 47.46,55.24 47.46,71.75 135.09,71.75 X3.2
N$58
  Top 0.406: IC1.15 44.92,57.78 44.92,73.02 132.55,73.02 X3.3
N$59
  Top 0.406: X3.4 133.82,76.83 133.82,80.64 140.17,80.64 140.17,69.21 57.62,69.21 IC1.14
N$60  (via drill 0.6)
  Top 0.406: IC2.18 119.85,51.43 v119.85,64.13 | v118.58,74.29 39.84,74.29 X4.8
  Bottom 0.406: v119.85,64.13 118.58,64.13 v118.58,74.29
N$61
  Bottom 0.406: IC1.18 38.57,50.16 38.57,71.75 42.38,71.75 X4.7